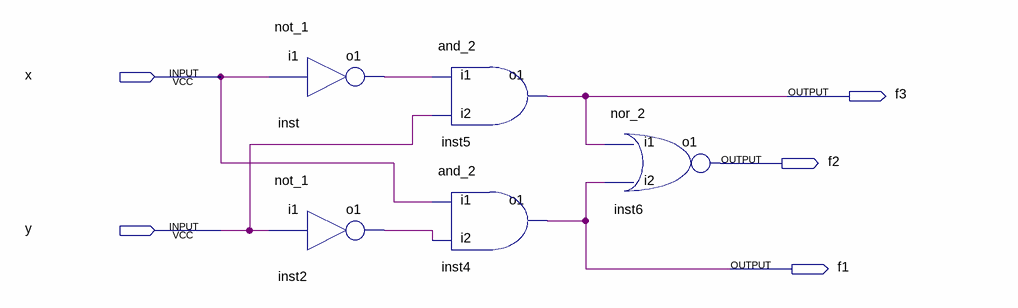
[diagram p0: schematic sheet]
// Quartus schematic comparator.bdf as structural Verilog: 5 symbols, 5 pins
module comparator (
  input  x,
  input  y,
  output f3,
  output f2,
  output f1
);

  wire inst2_o1, inst_o1;

  not_1 inst (.i1(x), .o1(inst_o1));
  not_1 inst2 (.i1(y), .o1(inst2_o1));
  and_2 inst5 (.i1(inst_o1), .i2(y), .o1(f3));
  and_2 inst4 (.i1(x), .i2(inst2_o1), .o1(f1));
  nor_2 inst6 (.i1(f3), .i2(f1), .o1(f2));
endmodule
